# Altium schematic sheet IDD_measurement.SchDoc: IDD_measurement
size A3; Project: STM32L073Z-EVAL; Date: Not used; ApprovedBy: Not used; CheckedBy: Not used; Author: Not used; CompanyName: STMicroelectronics; DrawnBy: Not used; Engineer: Not used; Organization: Not used; Address1: Not used; Address2: Not used; Address3: Not used; Address4: Not used; DocumentNumber: 10; Revision: Not used; SheetNumber: 11; SheetTotal: 13; CurrentTime: Not used; CurrentDate: Not used; Time: Not used; DocumentFullPathAndName: Not used; DocumentName: Not used; ModifiedDate: Not used; ImagePath: Not used; ProjectName: Not used; Application_BuildNumber: Not used
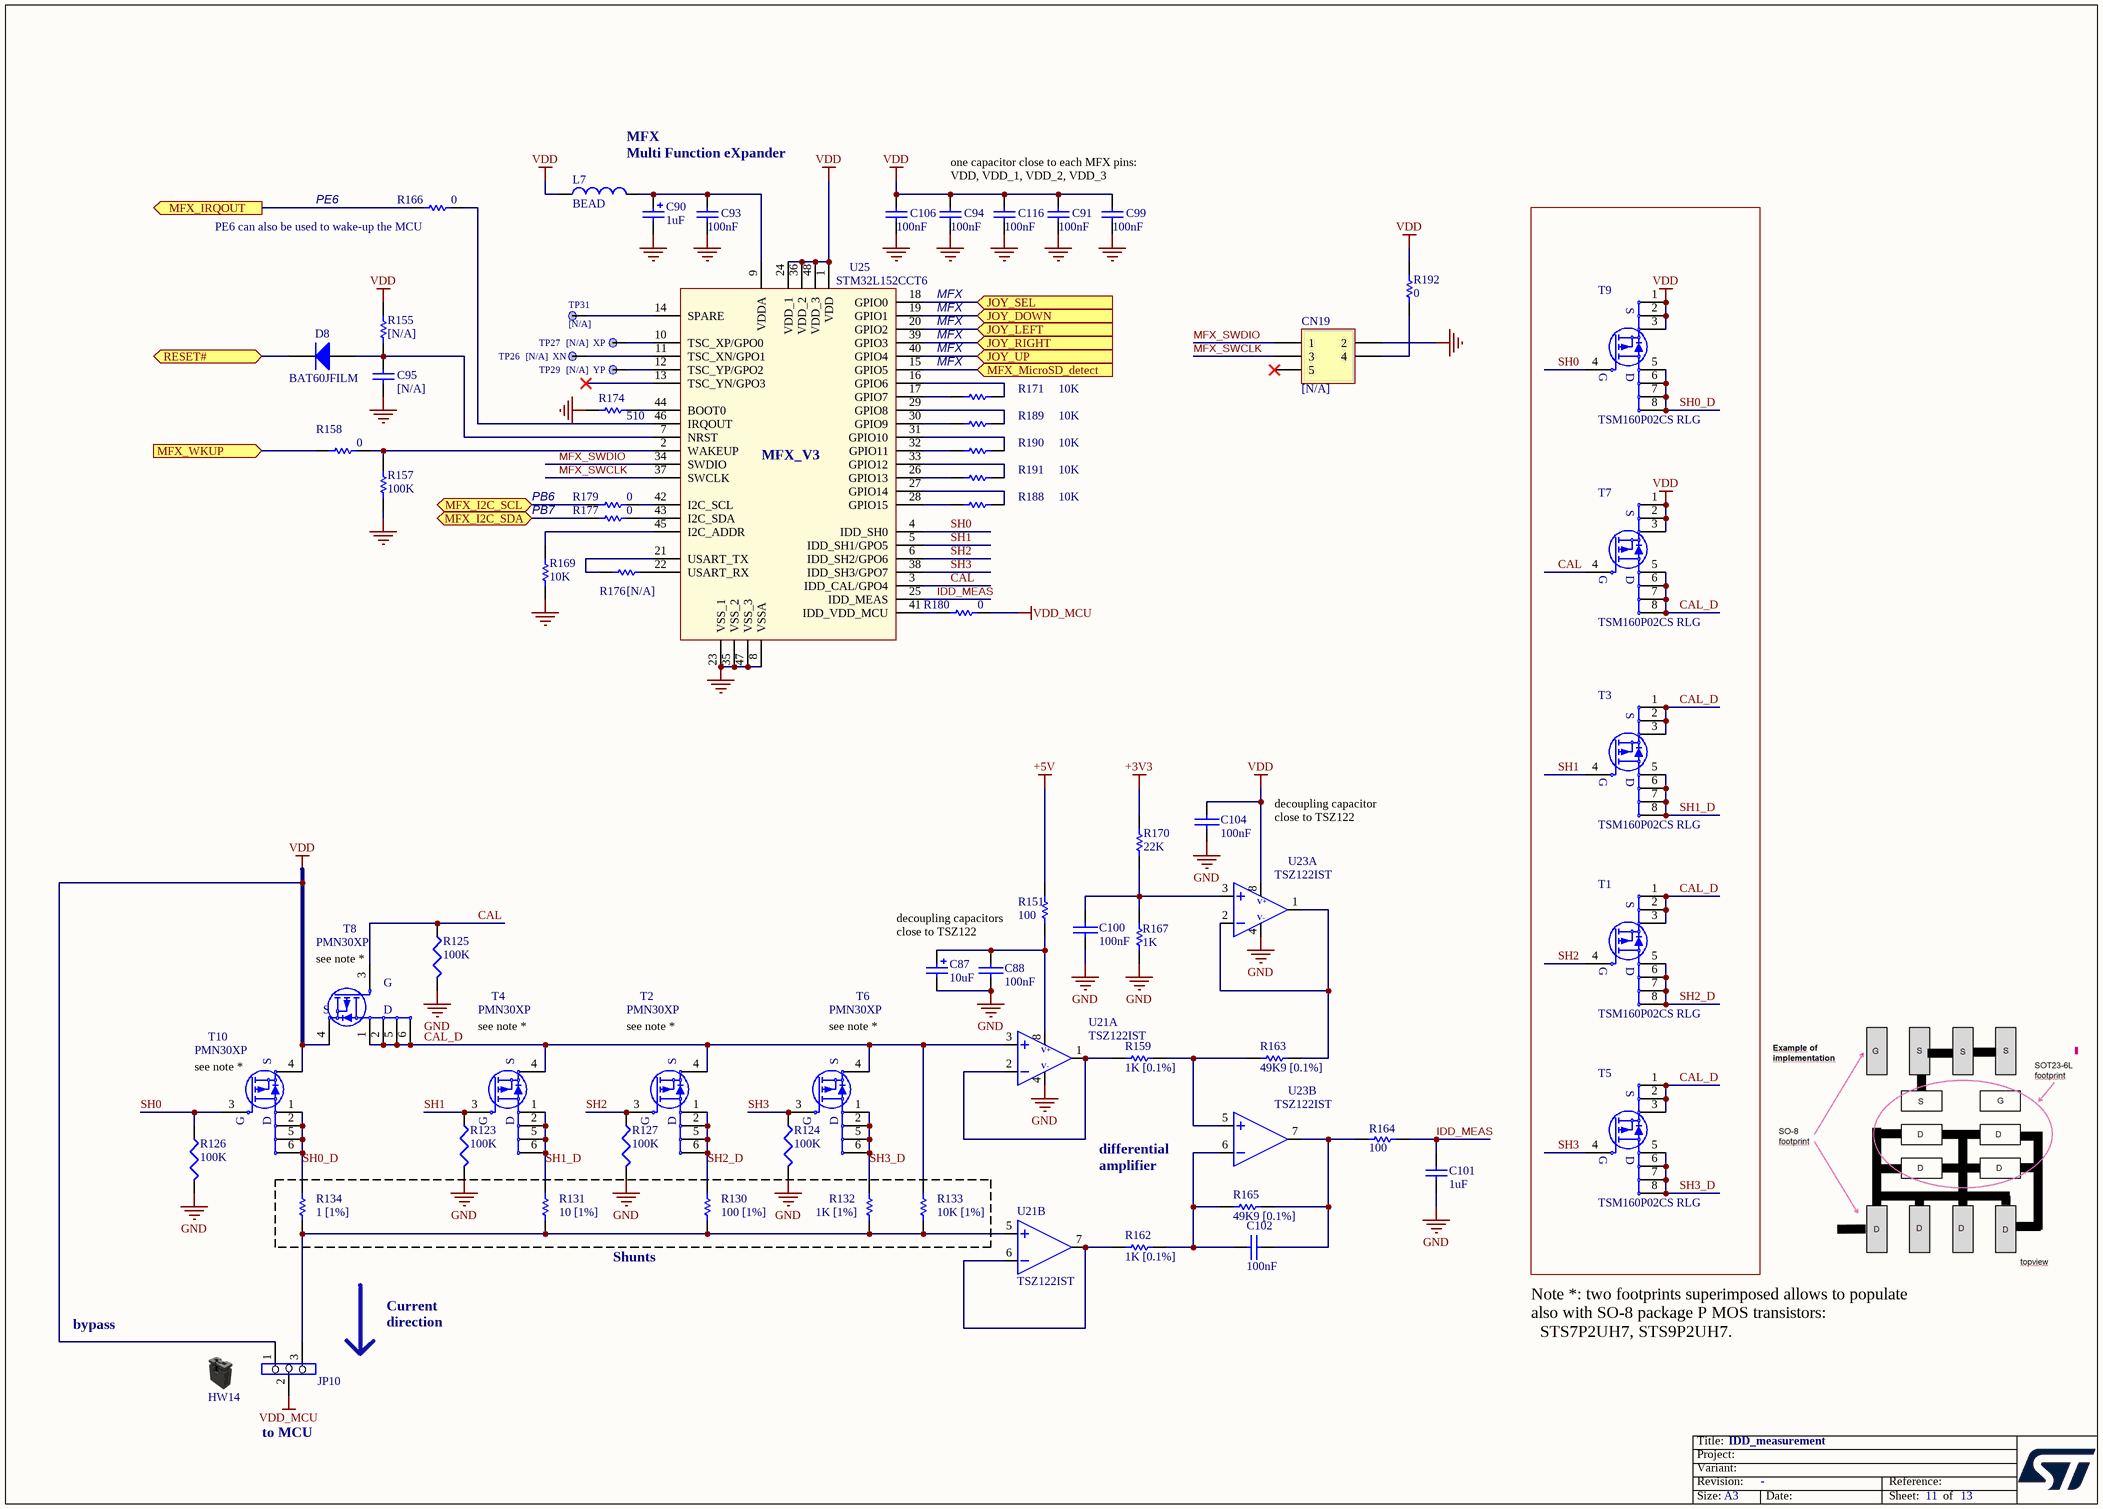
[diagram p0: IDD_measurement.SchDoc]

## Parts
C87  10uF  [TAN-A]
C88  100nF  [0402C]
C90  1uF  [TAN-A]
C91  100nF  [0402C]
C93  100nF  [0402C]
C94  100nF  [0402C]
C95  [N/A]  [0603C]
C99  100nF  [0402C]
C100  100nF  [0402C]
C101  1uF  [0603C]
C102  100nF  [0402C]
C104  100nF  [0402C]
C106  100nF  [0402C]
C116  100nF  [0402C]
CN19  [N/A]  [HDR_2X3-1_2R54-6]
D8  BAT60JFILM  [SOD-323]
HW14  Shunt Black 2.54mm  (value not drawn)  (mechanical)
JP10  (no value)  [SIP3]
L7  BEAD  [0603L]
R123  100K  [0402R]
R124  100K  [0402R]
R125  100K  [0402R]
R126  100K  [0402R]
R127  100K  [0402R]
R130  100 [1%]  [0603R]
R131  10 [1%]  [0603R]
R132  1K [1%]  [0603R]
R133  10K [1%]  [0603R]
R134  1 [1%]  [0603R]
R151  100  [0402R]
R155  [N/A]  [0603R]
R157  100K  [0402R]
R158  0  [0603R]
R159  1K [0.1%]  [0603R]
R162  1K [0.1%]  [0603R]
R163  49K9 [0.1%]  [0603R]
R164  100  [0402R]
R165  49K9 [0.1%]  [0603R]
R166  0  [0603R]
R167  1K  [0402R]
R169  10K  [0603R]
R170  22K  [0603R]
R171  10K  [0603R]
R174  510  [0402R]
R176  [N/A]  [0603R]
R177  0  [0603R]
R179  0  [0603R]
R180  0  [0603R]
R188  10K  [0603R]
R189  10K  [0603R]
R190  10K  [0603R]
R191  10K  [0603R]
R192  0  [0603R]
T1  TSM160P02CS RLG  [SOIC8_1R27_4R9X6]
T2  PMN30XP  [SOT23-6L]
T3  TSM160P02CS RLG  [SOIC8_1R27_4R9X6]
T4  PMN30XP  [SOT23-6L]
T5  TSM160P02CS RLG  [SOIC8_1R27_4R9X6]
T6  PMN30XP  [SOT23-6L]
T7  TSM160P02CS RLG  [SOIC8_1R27_4R9X6]
T8  PMN30XP  [SOT23-6L]
T9  TSM160P02CS RLG  [SOIC8_1R27_4R9X6]
T10  PMN30XP  [SOT23-6L]
TP26  [N/A]  Silkscreen: XN  [TP]
TP27  [N/A]  Silkscreen: XP  [TP]
TP29  [N/A]  Silkscreen: YP  [TP]
TP31  [N/A]  [TP]
U21  TSZ122IST  [MSOP8_0R65_3X4R9]  (parts A,B of 2)
U23  TSZ122IST  [MSOP8_0R65_3X4R9]  (parts A,B of 2)
U25  STM32L152CCT6  [LQFP48_0R5_9X9]

## Ports
JOY_DOWN (in), JOY_LEFT (in), JOY_RIGHT (in), JOY_SEL (in), JOY_UP (in), MFX_I2C_SCL (bidir), MFX_I2C_SDA (bidir), MFX_IRQOUT (out), MFX_MicroSD_detect (in), MFX_WKUP (in), RESET# (bidir)

## Nets
+3V3: R170.1
+5V: R151.1
GND: C87.2 C88.2 C90.2 C91.1 C93.1 C94.1 C95.1 C99.1 C100.2 C101.1 C104.2 C106.1 C116.2 CN19.2 R123.2 R124.2 R125.2 R126.2 R127.2 R157.2 R167.2 R169.1 R174.2 U21.4 U23.4 U25.8(VSSA) U25.23(VSS_1) U25.35(VSS_2) U25.47(VSS_3)
VDD: C91.2 C94.2 C99.2 C104.1 C106.2 C116.1 JP10.1 L7.1 R155.1 R192.2 T7.1(S) T7.2(S) T7.3(S) T8.4(S) T9.1(S) T9.2(S) T9.3(S) T10.4(S) U23.8 U25.1(VDD) U25.24(VDD_1) U25.36(VDD_2) U25.48(VDD_3)
VDD_MCU: JP10.2 R180.2
CAL: R125.1 T7.4(G) T8.3(G) U25.3(IDD_CAL/GPO4)
CAL_D: R133.2 T1.1(S) T1.2(S) T1.3(S) T2.4(S) T3.1(S) T3.2(S) T3.3(S) T4.4(S) T5.1(S) T5.2(S) T5.3(S) T6.4(S) T7.5(D) T7.6(D) T7.7(D) T7.8(D) T8.1(S) T8.2(S) T8.5(D) T8.6(D) U21.3
IDD_MEAS: C101.2 R164.1 U25.25(IDD_MEAS)
JOY_DOWN: U25.19(GPIO1) ; port JOY_DOWN
JOY_LEFT: U25.20(GPIO2) ; port JOY_LEFT
JOY_RIGHT: U25.39(GPIO3) ; port JOY_RIGHT
JOY_SEL: U25.18(GPIO0) ; port JOY_SEL
JOY_UP: U25.40(GPIO4) ; port JOY_UP
MFX_I2C_SCL: R179.1 ; port MFX_I2C_SCL
MFX_I2C_SDA: R177.1 ; port MFX_I2C_SDA
MFX_IRQOUT: R166.1 ; port MFX_IRQOUT
MFX_MicroSD_detect: U25.15(GPIO5) ; port MFX_MicroSD_detect
MFX_SWCLK: CN19.3 U25.37(SWCLK)
MFX_SWDIO: CN19.1 U25.34(SWDIO)
MFX_WKUP: R158.1 ; port MFX_WKUP
RESET#: D8.2(K) ; port RESET#
SH0: R126.1 T9.4(G) T10.3(G) U25.4(IDD_SH0)
SH0_D: R134.2 T9.5(D) T9.6(D) T9.7(D) T9.8(D) T10.1(S) T10.2(S) T10.5(D) T10.6(D)
SH1: R123.1 T3.4(G) T4.3(G) U25.5(IDD_SH1/GPO5)
SH1_D: R131.2 T3.5(D) T3.6(D) T3.7(D) T3.8(D) T4.1(S) T4.2(S) T4.5(D) T4.6(D)
SH2: R127.1 T1.4(G) T2.3(G) U25.6(IDD_SH2/GPO6)
SH2_D: R130.2 T1.5(D) T1.6(D) T1.7(D) T1.8(D) T2.1(S) T2.2(S) T2.5(D) T2.6(D)
SH3: R124.1 T5.4(G) T6.3(G) U25.38(IDD_SH3/GPO7)
SH3_D: R132.2 T5.5(D) T5.6(D) T5.7(D) T5.8(D) T6.1(S) T6.2(S) T6.5(D) T6.6(D)
NetC87_1: C87.1 C88.1 R151.2 U21.8
NetC90_1: C90.1 C93.2 L7.2 U25.9(VDDA)
NetC95_2: C95.2 D8.1(A) R155.2 U25.7(NRST)
NetC100_1: C100.1 R167.1 R170.2 U23.3
NetC102_1: C102.1 R162.2 R165.1 U23.6
NetC102_2: C102.2 R164.2 R165.2 U23.7
NetCN19_4: CN19.4 R192.1
NetJP10_3: JP10.3 R130.1 R131.1 R132.1 R133.1 R134.1 U21.5
NetR157_1: R157.1 R158.2 U25.2(WAKEUP)
NetR159_1: R159.1 U21.1 U21.2
NetR159_2: R159.2 R163.1 U23.5
NetR162_1: R162.1 U21.6 U21.7
NetR163_2: R163.2 U23.1 U23.2
NetR166_2: R166.2 U25.46(IRQOUT)
NetR169_2: R169.2 U25.45(I2C_ADDR)
NetR171_1: R171.1 U25.17(GPIO7)
NetR171_2: R171.2 U25.16(GPIO6)
NetR174_1: R174.1 U25.44(BOOT0)
NetR176_1: R176.1 U25.21(USART_TX)
NetR176_2: R176.2 U25.22(USART_RX)
NetR177_2: R177.2 U25.43(I2C_SDA)
NetR179_2: R179.2 U25.42(I2C_SCL)
NetR180_1: R180.1 U25.41(IDD_VDD_MCU)
NetR188_1: R188.1 U25.28(GPIO15)
NetR188_2: R188.2 U25.27(GPIO14)
NetR189_1: R189.1 U25.30(GPIO9)
NetR189_2: R189.2 U25.29(GPIO8)
NetR190_1: R190.1 U25.32(GPIO11)
NetR190_2: R190.2 U25.31(GPIO10)
NetR191_1: R191.1 U25.26(GPIO13)
NetR191_2: R191.2 U25.33(GPIO12)
NetTP26_1: TP26.1 U25.11(TSC_XN/GPO1)
NetTP27_1: TP27.1 U25.10(TSC_XP/GPO0)
NetTP29_1: TP29.1 U25.12(TSC_YP/GPO2)
NetTP31_1: TP31.1 U25.14(SPARE)

Not connected (* = marked no-connect by the designer): CN19 5*; U25 13(TSC_YN/GPO3)*

## Notes on the sheet
- MFX
  Multi Function eXpander
- (near R166) PE6 can also be used to wake-up the MCU
- PE6
- one capacitor close to each MFX pins: VDD, VDD_1, VDD_2, VDD_3
- (near U25) MFX
- MFX
- PB6
- PB7
- decoupling capacitor
  close to TSZ122
- (near T8) see note *
- decoupling capacitors
  close to TSZ122
- (near T4) see note *
- (near T2) see note *
- (near T6) see note *
- (near T10) see note *
- differential
  amplifier
- (near R130) Shunts
- bypass
- Current direction
- Note *: two footprints superimposed allows to populate also with SO-8 package P MOS transistors:
  STS7P2UH7, STS9P2UH7.
- (near JP10) to MCU
- Title:
- Project:
- Size:
- Revision:
- Variant:
- A3
- -
- Date:
- Reference:
- Sheet:
- of
- (in symbol AOP-8PINS, part A) V+; V-

## Library data of the parts
C87 = Cap Pol1: Polarized Capacitor (Radial); Ordered by: Subcon; Published: 8-Jun-2000; Revision: July-2002: Re-released for DXP Platform.; Publisher: Altium Limited; Value: 10uF; ECCN_US/EU: n/a
C88 C100 C102 C104 = CAP: Ordered by: Subcon; ECCN_US/EU: n/a
C90 = Cap_1uF_POL_10%_TANA: Polarized Capacitor; Manuf_Part_1: TC212A105K016; Manuf_1: AVX; Ordered by: Subcon; Revision: July-2002: Re-released for DXP Platform.; Value: 1uF; Order: *; Distrib: *; ECCN_US/EU: n/a
C91 C93 C94 C99 C106 C116 = Cap_100nF_X7R_10%_0402: Capacitor,100nF,16V,X7R,10%,0402,YAGEO; Manuf_Part_1: CC0402KRX7R7BB104; Ordered by: Subcon; Revision: July-2002: Re-released for DXP Platform.; Value: 100nF; Order: CC0402KRX7R7BB104; Manuf_1: YAGEO; ECCN_US/EU: n/a
C95 = cap: Capacitor; Value: 100pF; Ordered by: Subcon; Fitted: NO; Published: 8-Jun-2000; Revision: July-2002: Re-released for DXP Platform.; Publisher: Altium Limited; ECCN_US/EU: n/a
C101 = CAP: Capacitor; Value: 100nF; Ordered by: Subcon; Published: 8-Jun-2000; Revision: July-2002: Re-released for DXP Platform.; Publisher: Altium Limited; ECCN_US/EU: n/a
CN19 = Header 3X2: Header, 3-Pin, Dual row; Ordered by: Subcon; Fitted: NO; Revision: 17-Jul-2002: Re-released for DXP Platform.; Publisher: Altium Limited; ECCN_US/EU: n/a
D8 = Diode: Default Diode; Code - JEDEC: DO-214-AB; Ordered by: ST; ECCN_US/EU: EAR99/NEC; Ref St: 9151097; Published: 8-Jun-2000; Revision: July-2002: Re-released for DXP Platform.; Publisher: Altium Limited; Manuf_1: ST; Manuf_Part_1: BAT60JFILM
JP10 = Jumper3: Ordered by: Subcon; Silkscreen: 1,2: VDD / 2,3: IDD; Assembly: 2-3 (IDD); ECCN_US/EU: n/a
L7 = BEAD_600R_350MA_0603: Bead,600R,350mA,0603; Manuf_Part_1: FCM1608KF-601T05; Manuf_2: Wurth Elektronik; Manuf_Part_2: 742863160; Manuf_1: Tai-tech; Value: 100uH; Comment_1: bead,30R,5A,0603,MPZ1608S300A,TDK; Ordered by: Subcon; Revision: July-2002: Re-released for DXP Platform.; Order: *; ECCN_US/EU: n/a
R123-R127 = RES1: Resistor; Ordered by: Subcon; ECCN_US/EU: n/a
R130 R131 R133 R134 R151 R163 R165 R169-R171 R188-R191 = res1: Resistor; Value: 1K; Ordered by: Subcon; Published: 8-Jun-2000; Revision: July-2002: Re-released for DXP Platform.; Publisher: Altium Limited; ECCN_US/EU: n/a
R132 R159 R162 = res1: Resistor; Ordered by: Subcon; Published: 8-Jun-2000; Revision: July-2002: Re-released for DXP Platform.; Publisher: Altium Limited; Value: 1K; ECCN_US/EU: n/a
R155 = Res1: Resistor; Value: 1K; Ordered by: Subcon; Fitted: NO; Published: 8-Jun-2000; Revision: July-2002: Re-released for DXP Platform.; Publisher: Altium Limited; ECCN_US/EU: n/a
R157 R174 = Resistor_ST: Resistor 0402 / 0603 / 0805; Value: 10K; Ordered by: Subcon; ECCN_US/EU: n/a
R158 R164 R166 R177 R179 R180 R192 = Res1: Resistor; Value: 1K; Ordered by: Subcon; Published: 8-Jun-2000; Revision: July-2002: Re-released for DXP Platform.; Publisher: Altium Limited; ECCN_US/EU: n/a
R167 = Res1: Resistor; Ordered by: Subcon; Published: 8-Jun-2000; Revision: July-2002: Re-released for DXP Platform.; Publisher: Altium Limited; Value: 1K; ECCN_US/EU: n/a
R176 = res1: Resistor; Value: 1K; Ordered by: Subcon; Fitted: NO; Published: 8-Jun-2000; Revision: July-2002: Re-released for DXP Platform.; Publisher: Altium Limited; ECCN_US/EU: n/a
T1 = STS7P2UH7: STripFET VII Power MOSFET, P-CHANNEL 20V - 0.023 - 7A - SO-8; Manuf_Part_1: STS9P2UH7; Manuf_1: ST; Manuf_2: STM; Ref St: 9153052; ECCN_US/EU: EAR99/NEC; Comments: exclusive with T2; Order: STS9P2UH7; Distrib: ST; Provided: ST; Ordered by: ST; Manuf_Part_2: STS7P2UH7
T2 = STT7P2UH7: STripFET VII DeepGATE Power MOSFET, P-CHANNEL 20 V, 0.0146, 7 A - SOT23-6L; Manuf_1: ST; Ref St: 9153048; ECCN_US/EU: EAR99/NEC; Comments: exclusive with T1; Fitted: NO; Manuf_Part_1: STT7P2UH7; Order: STT7P2UH7; Distrib: ST; Provided: ST; Ordered by: ST
T3 = STS7P2UH7: STripFET VII Power MOSFET, P-CHANNEL 20V - 0.023 - 7A - SO-8; Manuf_Part_1: STS9P2UH7; Manuf_1: ST; Manuf_2: STM; Ref St: 9153052; ECCN_US/EU: EAR99/NEC; Comments: exclusive with T4; Order: STS9P2UH7; Distrib: ST; Provided: ST; Ordered by: ST; Manuf_Part_2: STS7P2UH7
T4 = STT7P2UH7: STripFET VII DeepGATE Power MOSFET, P-CHANNEL 20 V, 0.0146, 7 A - SOT23-6L; Manuf_1: ST; Ref St: 9153048; ECCN_US/EU: EAR99/NEC; Comments: exclusive with T3; Fitted: NO; Manuf_Part_1: STT7P2UH7; Order: STT7P2UH7; Distrib: ST; Provided: ST; Ordered by: ST
T5 = STS7P2UH7: STripFET VII Power MOSFET, P-CHANNEL 20V - 0.023 - 7A - SO-8; Manuf_Part_1: STS9P2UH7; Manuf_1: ST; Manuf_2: STM; Ref St: 9153052; ECCN_US/EU: EAR99/NEC; Comments: exclusive with T6; Order: STS9P2UH7; Distrib: ST; Provided: ST; Ordered by: ST; Manuf_Part_2: STS7P2UH7
T6 = STT7P2UH7: STripFET VII DeepGATE Power MOSFET, P-CHANNEL 20 V, 0.0146, 7 A - SOT23-6L; Manuf_1: ST; Ref St: 9153048; ECCN_US/EU: EAR99/NEC; Comments: exclusive with T5; Fitted: NO; Manuf_Part_1: STT7P2UH7; Order: STT7P2UH7; Distrib: ST; Provided: ST; Ordered by: ST
T7 = STS7P2UH7: STripFET VII Power MOSFET, P-CHANNEL 20V - 0.023 - 7A - SO-8; Manuf_Part_1: STS9P2UH7; Manuf_1: ST; Manuf_2: STM; Ref St: 9153052; ECCN_US/EU: EAR99/NEC; Comments: exclusive with T8; Order: STS9P2UH7; Distrib: ST; Provided: ST; Ordered by: ST; Manuf_Part_2: STS7P2UH7
T8 = STT7P2UH7: STripFET VII DeepGATE Power MOSFET, P-CHANNEL 20 V, 0.0146, 7 A - SOT23-6L; Manuf_1: ST; Ref St: 9153048; ECCN_US/EU: EAR99/NEC; Comments: exclusive with T7; Fitted: NO; Manuf_Part_1: STT7P2UH7; Order: STT7P2UH7; Distrib: ST; Provided: ST; Ordered by: ST
T9 = STS7P2UH7: STripFET VII Power MOSFET, P-CHANNEL 20V - 0.023 - 7A - SO-8; Manuf_Part_1: STS9P2UH7; Manuf_1: ST; Manuf_2: STM; Ref St: 9153052; ECCN_US/EU: EAR99/NEC; Comments: exclusive with T10; Order: STS9P2UH7; Distrib: ST; Provided: ST; Ordered by: ST; Manuf_Part_2: STS7P2UH7
T10 = STT7P2UH7: STripFET VII DeepGATE Power MOSFET, P-CHANNEL 20 V, 0.0146, 7 A - SOT23-6L; Manuf_1: ST; Ref St: 9153048; ECCN_US/EU: EAR99/NEC; Comments: exclusive with T9; Fitted: NO; Manuf_Part_1: STT7P2UH7; Order: STT7P2UH7; Distrib: ST; Provided: ST; Ordered by: ST
TP26 TP27 TP29 TP31 = TP: Ordered by: Subcon; Fitted: NO; ECCN_US/EU: n/a
U21 U23 = AOP-8PINS: Ordered by: ST; ECCN_US/EU: EAR99/NEC; Ref St: 9177443; Manuf_1: ST; Manuf_Part_1: TSZ122IST
U25 = MFX_V3: Multifunction expander; ECCN_US/EU: 3A991A2/NEC; Ordered by: ST; Ref St: 9175875; Manuf_1: ST; Manuf_Part_1: STM32L152CCT6